# Altium project PlatypusDAQ.PrjPCB (part 2 of 2)

## Sheet GumstixInterface.SchDoc
size C
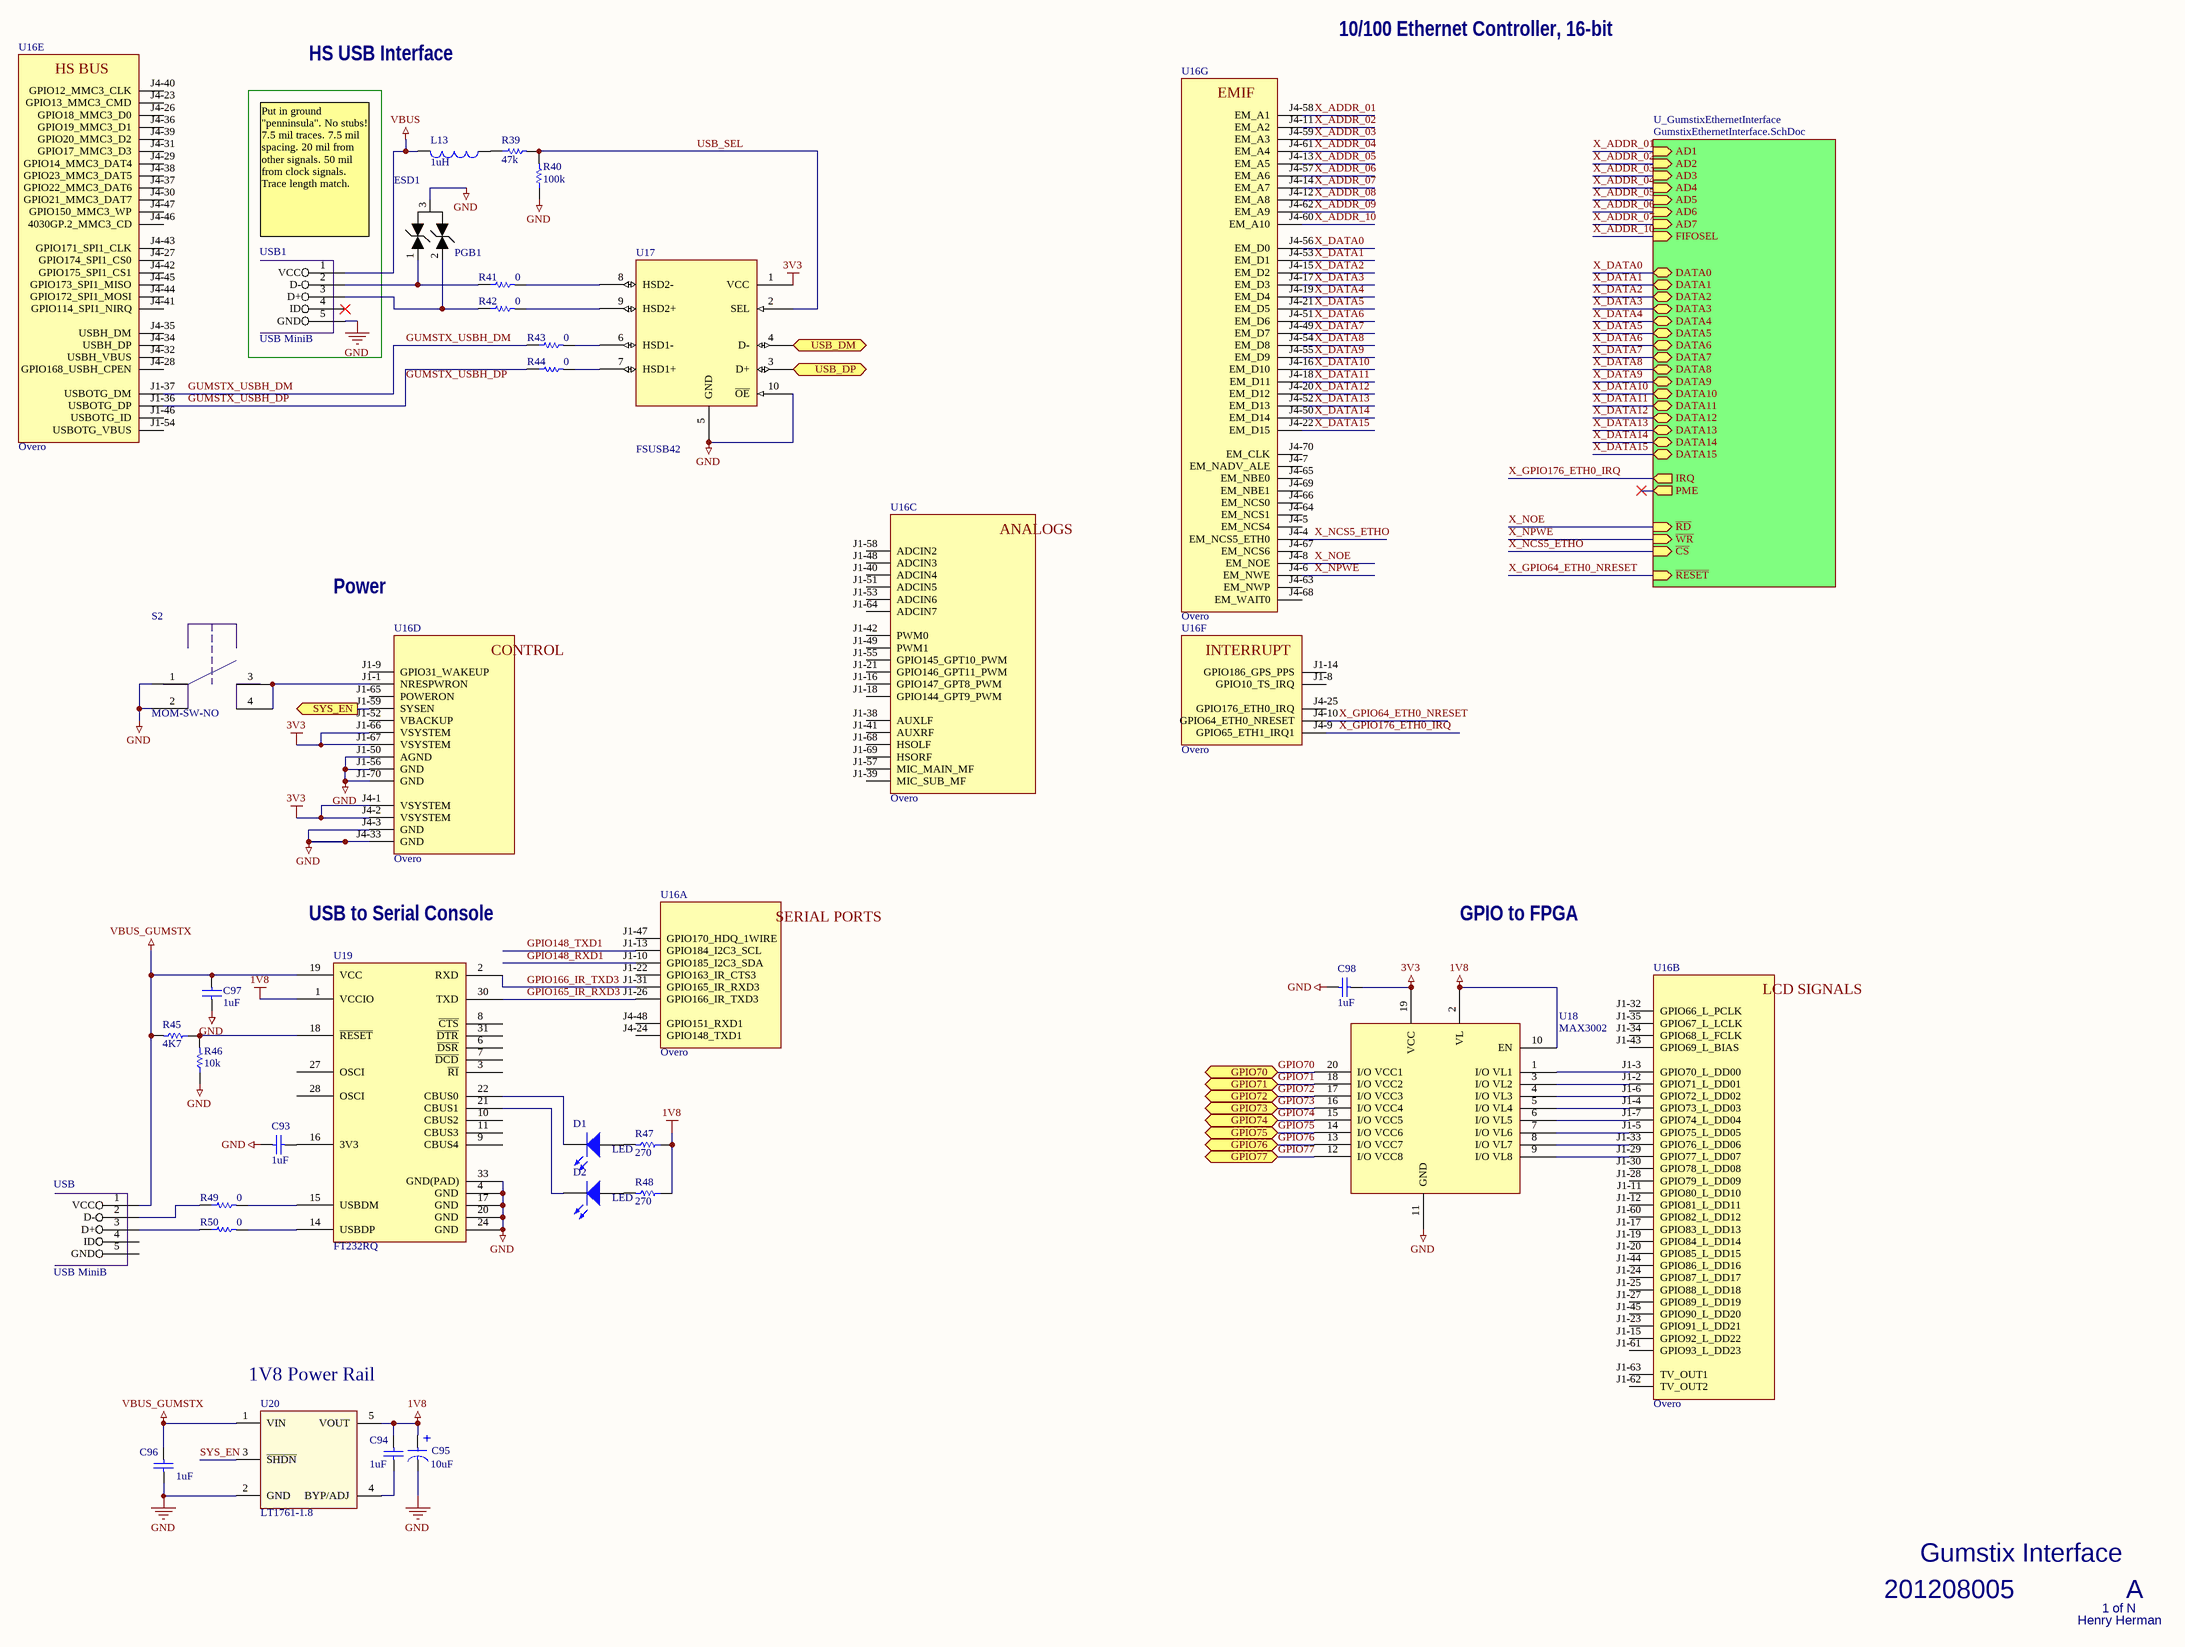
[diagram p4: GumstixInterface.SchDoc]

### Parts
C93  Label: 1uF  [SM/C_0603]  (hidden comment: CAP)
C94  Label: 1uF  [SM/C_0603]  (hidden comment: CAP)
C95  Label: 10uF  [SM/C_POL_0805]  (hidden comment: CAP_POL)
C96  Label: 1uF  [SM/C_0603]  (hidden comment: CAP)
C97  Label: 1uF  [SM/C_0603]  (hidden comment: CAP)
C98  Label: 1uF  [SM/C_0603]  (hidden comment: CAP)
D1  LED  [LED-1206]
D2  LED  [LED-1206]
ESD1  PGB1  [SOT23-PGB1-ESD]
L13  value 1uH  [SM/L_0805]  (hidden comment: Inductor)
R39  value 47k  [SM/R_0603]  (hidden comment: Res)
R40  value 100k  [SM/R_0603]  (hidden comment: Res)
R41  value 0  [SM/R_0603]  (hidden comment: Res)
R42  value 0  [SM/R_0603]  (hidden comment: Res)
R43  value 0  [SM/R_0603]  (hidden comment: Res)
R44  value 0  [SM/R_0603]  (hidden comment: Res)
R45  value 4K7  [SM/R_0603]  (hidden comment: Res)
R46  value 10k  [SM/R_0603]  (hidden comment: Res)
R47  value 270  [SM/R_0603]  (hidden comment: Res)
R48  value 270  [SM/R_0603]  (hidden comment: Res)
R49  value 0  [SM/R_0603]  (hidden comment: Res)
R50  value 0  [SM/R_0603]  (hidden comment: Res)
S2  MOM-SW-NO  [MOM-SW]
U16  Overo  [OVERO]  (parts A,B,C,D,E,F,G of 7)
U17  FSUSB42  [MSOP-10LEAD-FairchildSemi-USBMux]
U18  MAX3002  [TSSOP-20Lead-MAXIM]
U19  FT232RQ  [QFN32-FT232RQ]
U20  LT1761-1.8  [TSOT-23-5Lead-LTC3406A]
USB  USB MiniB  [USB-MINIB]
USB1  USB MiniB  [USB-MINIB]

### Sub-sheets
U_GumstixEthernetInterface = GumstixEthernetInterface.SchDoc: AD1 (in), AD2 (in), AD3 (in), AD4 (in), AD5 (in), AD6 (in), AD7 (in), DATA0 (bidir), DATA1 (bidir), DATA2 (bidir), DATA3 (bidir), DATA4 (bidir), DATA5 (bidir), DATA6 (bidir), DATA7 (bidir), DATA8 (bidir), DATA9 (bidir), DATA10 (bidir), DATA11 (bidir), DATA12 (bidir), DATA13 (bidir), DATA14 (bidir), DATA15 (bidir), ~{RD} (in), ~{WR} (in), ~{CS} (in), IRQ (out), FIFOSEL (in), PME (out), ~{RESET} (in)

### Ports
GPIO70 (bidir), GPIO71 (bidir), GPIO72 (bidir), GPIO73 (bidir), GPIO74 (bidir), GPIO75 (bidir), GPIO76 (bidir), GPIO77 (bidir), SYS_EN (out), USB_DM (bidir), USB_DP (bidir)

### Nets
1V8: C94.2 C95.1 R47.1 R48.1 U18.2(VL) U18.10(EN) U19.1(VCCIO) U20.5(VOUT)
3V3: C98.2 U16.J1-66(VSYSTEM) U16.J1-67(VSYSTEM) U16.J4-1(VSYSTEM) U16.J4-2(VSYSTEM) U17.1(VCC) U18.19(VCC)
GND: C93.2 C95.2 C96.1 C97.2 C98.1 ESD1.3 R40.1 R46.1 S2.1 S2.2 U16.J1-50(AGND) U16.J1-56(GND) U16.J1-70(GND) U16.J4-3(GND) U16.J4-33(GND) U17.5(GND) U17.10(~{OE}) U18.11(GND) U19.4(GND) U19.17(GND) U19.20(GND) U19.24(GND) U19.33(GND(PAD)) U20.2(GND) USB1.5(GND)
VBUS: L13.2 USB1.1(VCC)
VBUS_GUMSTX: C96.2 C97.1 R45.2 U19.19(VCC) U20.1(VIN) USB.1(VCC)
GPIO70: U18.20(I/O_VCC1) ; port GPIO70
GPIO71: U18.18(I/O_VCC2) ; port GPIO71
GPIO72: U18.17(I/O_VCC3) ; port GPIO72
GPIO73: U18.16(I/O_VCC4) ; port GPIO73
GPIO74: U18.15(I/O_VCC5) ; port GPIO74
GPIO75: U18.14(I/O_VCC6) ; port GPIO75
GPIO76: U18.13(I/O_VCC7) ; port GPIO76
GPIO77: U18.12(I/O_VCC8) ; port GPIO77
GPIO148_RXD1: U16.J1-10(GPIO185_I2C3_SDA)
GPIO148_TXD1: U16.J1-13(GPIO184_I2C3_SCL)
GPIO165_IR_RXD3: U16.J1-26(GPIO166_IR_TXD3) U19.30(TXD)
GPIO166_IR_TXD3: U16.J1-31(GPIO165_IR_RXD3) U19.2(RXD)
GUMSTX_USBH_DM: R43.1 U16.J1-37(USBOTG_DM)
GUMSTX_USBH_DP: R44.1 U16.J1-36(USBOTG_DP)
SYS_EN: U20.3(~{SHDN})
USB_SEL: R39.2 R40.2 U17.2(SEL)
X_ADDR_01: U16.J4-58(EM_A1) ; sheet U_GumstixEthernetInterface/AD1
X_ADDR_02: U16.J4-11(EM_A2) ; sheet U_GumstixEthernetInterface/AD2
X_ADDR_03: U16.J4-59(EM_A3) ; sheet U_GumstixEthernetInterface/AD3
X_ADDR_04: U16.J4-61(EM_A4) ; sheet U_GumstixEthernetInterface/AD4
X_ADDR_05: U16.J4-13(EM_A5) ; sheet U_GumstixEthernetInterface/AD5
X_ADDR_06: U16.J4-57(EM_A6) ; sheet U_GumstixEthernetInterface/AD6
X_ADDR_07: U16.J4-14(EM_A7) ; sheet U_GumstixEthernetInterface/AD7
X_ADDR_08: U16.J4-12(EM_A8)
X_ADDR_09: U16.J4-62(EM_A9)
X_ADDR_10: U16.J4-60(EM_A10) ; sheet U_GumstixEthernetInterface/FIFOSEL
X_DATA0: U16.J4-56(EM_D0) ; sheet U_GumstixEthernetInterface/DATA0
X_DATA1: U16.J4-53(EM_D1) ; sheet U_GumstixEthernetInterface/DATA1
X_DATA2: U16.J4-15(EM_D2) ; sheet U_GumstixEthernetInterface/DATA2
X_DATA3: U16.J4-17(EM_D3) ; sheet U_GumstixEthernetInterface/DATA3
X_DATA4: U16.J4-19(EM_D4) ; sheet U_GumstixEthernetInterface/DATA4
X_DATA5: U16.J4-21(EM_D5) ; sheet U_GumstixEthernetInterface/DATA5
X_DATA6: U16.J4-51(EM_D6) ; sheet U_GumstixEthernetInterface/DATA6
X_DATA7: U16.J4-49(EM_D7) ; sheet U_GumstixEthernetInterface/DATA7
X_DATA8: U16.J4-54(EM_D8) ; sheet U_GumstixEthernetInterface/DATA8
X_DATA9: U16.J4-55(EM_D9) ; sheet U_GumstixEthernetInterface/DATA9
X_DATA10: U16.J4-16(EM_D10) ; sheet U_GumstixEthernetInterface/DATA10
X_DATA11: U16.J4-18(EM_D11) ; sheet U_GumstixEthernetInterface/DATA11
X_DATA12: U16.J4-20(EM_D12) ; sheet U_GumstixEthernetInterface/DATA12
X_DATA13: U16.J4-52(EM_D13) ; sheet U_GumstixEthernetInterface/DATA13
X_DATA14: U16.J4-50(EM_D14) ; sheet U_GumstixEthernetInterface/DATA14
X_DATA15: U16.J4-22(EM_D15) ; sheet U_GumstixEthernetInterface/DATA15
X_GPIO64_ETH0_NRESET: U16.J4-10(GPIO64_ETH0_NRESET) ; sheet U_GumstixEthernetInterface/~{RESET}
X_GPIO176_ETH0_IRQ: U16.J4-9(GPIO65_ETH1_IRQ1) ; sheet U_GumstixEthernetInterface/IRQ
X_NCS5_ETHO: U16.J4-4(EM_NCS5_ETH0) ; sheet U_GumstixEthernetInterface/~{CS}
X_NOE: U16.J4-8(EM_NOE) ; sheet U_GumstixEthernetInterface/~{RD}
X_NPWE: U16.J4-6(EM_NWE) ; sheet U_GumstixEthernetInterface/~{WR}
NetC93_1: C93.1 U19.16(3V3)
NetC94_1: C94.1 U20.4(BYP/ADJ)
NetD1_1: D1.1(A) R47.2
NetD1_2: D1.2(K) U19.22(CBUS0)
NetD2_1: D2.1(A) R48.2
NetD2_2: D2.2(K) U19.21(CBUS1)
NetESD1_1: ESD1.1 R41.1 USB1.2(D-)
NetESD1_2: ESD1.2 R42.1 USB1.3(D+)
NetL13_1: L13.1 R39.1
NetR41_2: R41.2 U17.8(HSD2-)
NetR42_2: R42.2 U17.9(HSD2+)
NetR43_2: R43.2 U17.6(HSD1-)
NetR44_2: R44.2 U17.7(HSD1+)
NetR45_1: R45.1 R46.2 U19.18(~{RESET})
NetR49_1: R49.1 USB.2(D-)
NetR49_2: R49.2 U19.15(USBDM)
NetR50_1: R50.1 USB.3(D+)
NetR50_2: R50.2 U19.14(USBDP)
NetS2_3: S2.3 S2.4 U16.J1-1(NRESPWRON)
NetU3_7: U17.4(D-) ; port USB_DM
NetU3_8: U17.3(D+) ; port USB_DP
NetU16_J1-2: U16.J1-2(GPIO71_L_DD01) U18.3(I/O_VL2)
NetU16_J1-3: U16.J1-3(GPIO70_L_DD00) U18.1(I/O_VL1)
NetU16_J1-4: U16.J1-4(GPIO73_L_DD03) U18.5(I/O_VL4)
NetU16_J1-5: U16.J1-5(GPIO75_L_DD05) U18.7(I/O_VL6)
NetU16_J1-6: U16.J1-6(GPIO72_L_DD02) U18.4(I/O_VL3)
NetU16_J1-7: U16.J1-7(GPIO74_L_DD04) U18.6(I/O_VL5)
NetU16_J1-29: U16.J1-29(GPIO77_L_DD07) U18.9(I/O_VL8)
NetU16_J1-33: U16.J1-33(GPIO76_L_DD06) U18.8(I/O_VL7)
NetU16_J1-59: U16.J1-59(SYSEN) ; port SYS_EN

Not connected (* = marked no-connect by the designer): U16 J1-8(GPIO10_TS_IRQ) J1-9(GPIO31_WAKEUP) J1-11(GPIO80_L_DD10) J1-12(GPIO81_L_DD11) J1-14(GPIO186_GPS_PPS) J1-15(GPIO92_L_DD22) J1-16(GPIO147_GPT8_PWM) J1-17(GPIO83_L_DD13) J1-18(GPIO144_GPT9_PWM) J1-19(GPIO84_L_DD14) J1-20(GPIO85_L_DD15) J1-21(GPIO146_GPT11_PWM) J1-22(GPIO163_IR_CTS3) J1-23(GPIO91_L_DD21) J1-24(GPIO87_L_DD17) J1-25(GPIO88_L_DD18) J1-27(GPIO89_L_DD19) J1-28(GPIO79_L_DD09) J1-30(GPIO78_L_DD08) J1-32(GPIO66_L_PCLK) J1-34(GPIO68_L_FCLK) J1-35(GPIO67_L_LCLK) J1-38(AUXLF) J1-39(MIC_SUB_MF) J1-40(ADCIN4) J1-41(AUXRF) J1-42(PWM0) J1-43(GPIO69_L_BIAS) J1-44(GPIO86_L_DD16) J1-45(GPIO90_L_DD20) J1-46(USBOTG_ID) J1-47(GPIO170_HDQ_1WIRE) J1-48(ADCIN3) J1-49(PWM1) J1-51(ADCIN5) J1-52(VBACKUP) J1-53(ADCIN6) J1-54(USBOTG_VBUS) J1-55(GPIO145_GPT10_PWM) J1-57(MIC_MAIN_MF) J1-58(ADCIN2) J1-60(GPIO82_L_DD12) J1-61(GPIO93_L_DD23) J1-62(TV_OUT2) J1-63(TV_OUT1) J1-64(ADCIN7) J1-65(POWERON) J1-68(HSOLF) J1-69(HSORF) J4-5(EM_NCS4) J4-7(EM_NADV_ALE) J4-23(GPIO13_MMC3_CMD) J4-24(GPIO148_TXD1) J4-25(GPIO176_ETH0_IRQ) J4-26(GPIO18_MMC3_D0) J4-27(GPIO174_SPI1_CS0) J4-28(GPIO168_USBH_CPEN) J4-29(GPIO14_MMC3_DAT4) J4-30(GPIO21_MMC3_DAT7) J4-31(GPIO17_MMC3_D3) J4-32(USBH_VBUS) J4-34(USBH_DP) J4-35(USBH_DM) J4-36(GPIO19_MMC3_D1) J4-37(GPIO22_MMC3_DAT6) J4-38(GPIO23_MMC3_DAT5) J4-39(GPIO20_MMC3_D2) J4-40(GPIO12_MMC3_CLK) J4-41(GPIO114_SPI1_NIRQ) J4-42(GPIO175_SPI1_CS1) J4-43(GPIO171_SPI1_CLK) J4-44(GPIO172_SPI1_MOSI) J4-45(GPIO173_SPI1_MISO) J4-46(4030GP.2_MMC3_CD) J4-47(GPIO150_MMC3_WP) J4-48(GPIO151_RXD1) J4-63(EM_NWP) J4-64(EM_NCS1) J4-65(EM_NBE0) J4-66(EM_NCS0) J4-67(EM_NCS6) J4-68(EM_WAIT0) J4-69(EM_NBE1) J4-70(EM_CLK); U19 3(~{RI}) 6(~{DSR}) 7(~{DCD}) 8(~{CTS}) 9(CBUS4) 10(CBUS2) 11(CBUS3) 27(OSCI) 28(OSCI) 31(~{DTR}); USB 4(ID) 5(GND); USB1 4(ID)*

### Notes on the sheet
- 10/100 Ethernet Controller, 16-bit
- HS USB Interface
- Put in ground "penninsula". No stubs! 7.5 mil traces. 7.5 mil spacing. 20 mil from other signals. 50 mil from clock signals.
  Trace length match.
- Power
- USB to Serial Console
- GPIO to FPGA
- (near U20) 1V8 Power Rail
- Gumstix Interface
- 201208005
- Henry Herman
- 1 of N
- A
- (in symbol Overo, part A) SERIAL PORTS
- (in symbol Overo, part B) LCD SIGNALS
- (in symbol Overo, part C) ANALOGS
- (in symbol Overo, part D) CONTROL
- (in symbol Overo, part E) HS BUS
- (in symbol Overo, part F) INTERRUPT
- (in symbol Overo, part G) EMIF

### Library data of the parts
C93 C94 C96-C98 = CAP: Value: 1uF
C95 = CAP_POL: CAP; Value: 10uF
ESD1 = PGB102ST23
R39-R50 = Res: Resistor; Published: 8-Jun-2000; LatestRevisionDate: 17-Jul-2002; LatestRevisionNote: Re-released for DXP Platform.; PackageReference: AXIAL-0.3; Publisher: Altium Limited
S2 = MOM-BUT
U16 = Overo: Gumstix Overo COM
U19 = FT232R
U20 = LT1761-X
USB USB1 = USB MiniB: Mini USB; Published: 8-Jun-2000; LatestRevisionDate: 17-Jan-2003; LatestRevisionNote: PCB Footprint 'BCY-W3/D4.7' replaced; DatasheetDocument: 1997; PackageDocument: Sep-1998; PackageReference: TO-92A; Publisher: Altium Limited; ComponentLink1Description: Manufacturer Link; ComponentLink1URL: http://www.fairchildsemi.com/; ComponentLink2Description: Datasheet; ComponentLink2URL: http://www.fairchildsemi.com/ds/2N%2F2N3904.pdf

## Sheet GumstixEthernetInterface.SchDoc
size B
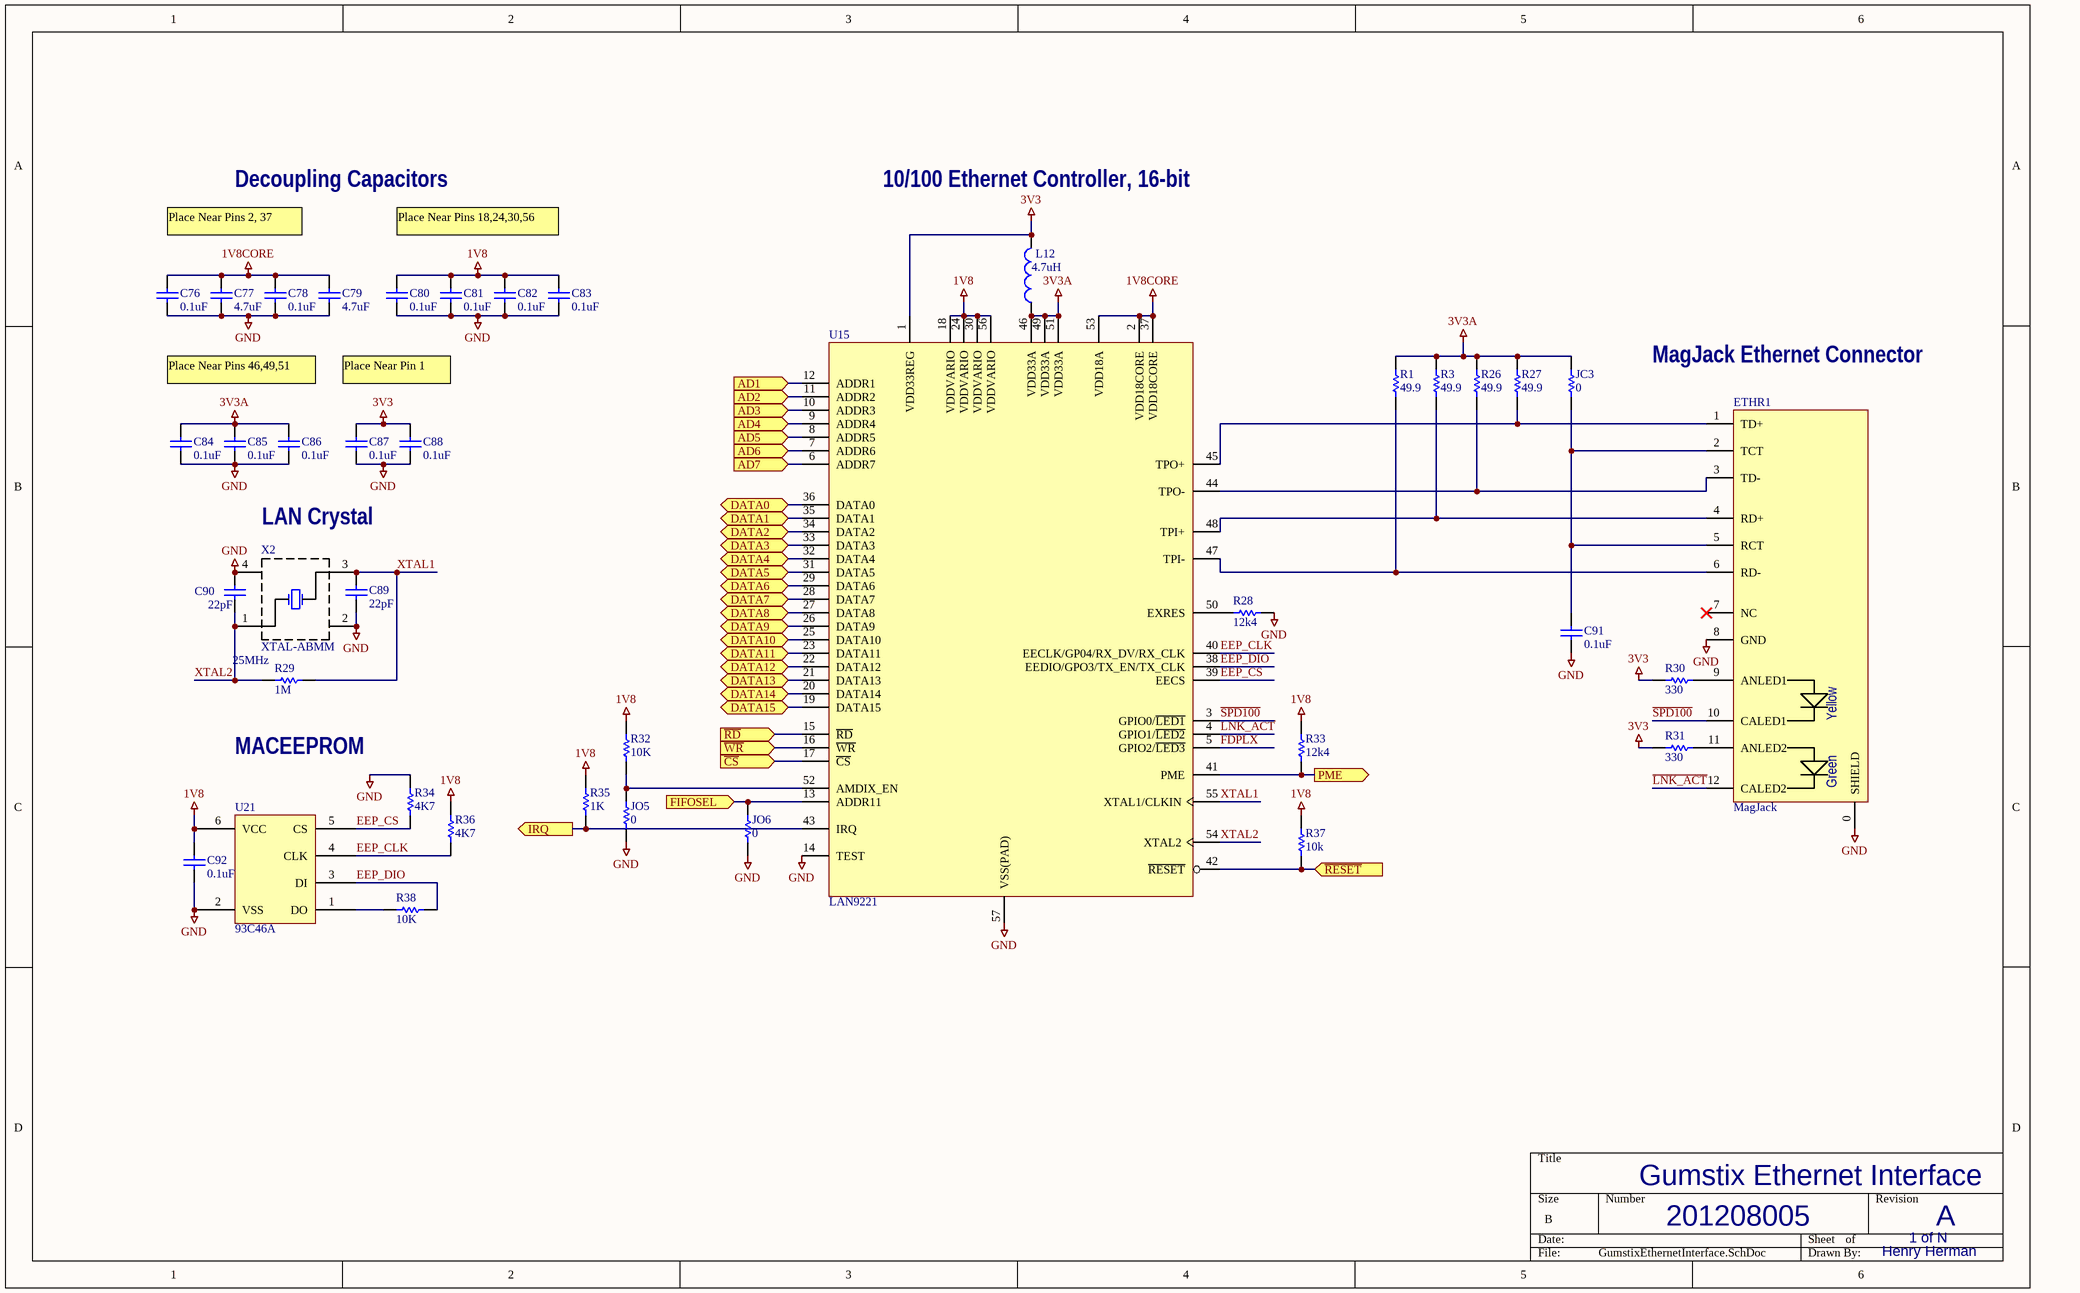
[diagram p5: GumstixEthernetInterface.SchDoc]

### Parts
C76  Label: 0.1uF  [SM/C_0402]  (hidden comment: CAP)
C77  Label: 4.7uF  [SM/C_0603]  (hidden comment: CAP)
C78  Label: 0.1uF  [SM/C_0402]  (hidden comment: CAP)
C79  Label: 4.7uF  [SM/C_0603]  (hidden comment: CAP)
C80  Label: 0.1uF  [SM/C_0402]  (hidden comment: CAP)
C81  Label: 0.1uF  [SM/C_0402]  (hidden comment: CAP)
C82  Label: 0.1uF  [SM/C_0402]  (hidden comment: CAP)
C83  Label: 0.1uF  [SM/C_0402]  (hidden comment: CAP)
C84  Label: 0.1uF  [SM/C_0402]  (hidden comment: CAP)
C85  Label: 0.1uF  [SM/C_0402]  (hidden comment: CAP)
C86  Label: 0.1uF  [SM/C_0402]  (hidden comment: CAP)
C87  Label: 0.1uF  [SM/C_0402]  (hidden comment: CAP)
C88  Label: 0.1uF  [SM/C_0402]  (hidden comment: CAP)
C89  Label: 22pF  [SM/C_0402]  (hidden comment: CAP)
C90  Label: 22pF  [SM/C_0402]  (hidden comment: CAP)
C91  Label: 0.1uF  [SM/C_0402]  (hidden comment: CAP)
C92  Label: 0.1uF  [SM/C_0603]  (hidden comment: CAP)
ETHR1  MagJack  [MagJack]
JC3  value 0  [SM/R_0603]  (hidden comment: Res)
JO5  value 0  [SM/R_0603]  (hidden comment: Res)
JO6  value 0  [SM/R_0603]  (hidden comment: Res)
L12  value 4.7uH  [SM/L_0805]  (hidden comment: Inductor)
R1  value 49.9  [SM/R_0603]  (hidden comment: Res)
R3  value 49.9  [SM/R_0603]  (hidden comment: Res)
R26  value 49.9  [SM/R_0603]  (hidden comment: Res)
R27  value 49.9  [SM/R_0603]  (hidden comment: Res)
R28  value 12k4  [SM/R_0603]  (hidden comment: Res)
R29  value 1M  [SM/R_0603]  (hidden comment: Res)
R30  value 330  [SM/R_0603]  (hidden comment: Res)
R31  value 330  [SM/R_0603]  (hidden comment: Res)
R32  value 10K  [SM/R_0603]  (hidden comment: Res)
R33  value 12k4  [SM/R_0603]  (hidden comment: Res)
R34  value 4K7  [SM/R_0603]  (hidden comment: Res)
R35  value 1K  [SM/R_0603]  (hidden comment: Res)
R36  value 4K7  [SM/R_0603]  (hidden comment: Res)
R37  value 10k  [SM/R_0603]  (hidden comment: Res)
R38  value 10K  [SM/R_0603]  (hidden comment: Res)
U15  LAN9221  [QFN-56Pin-SMSC-LAN9221]
U21  93C46A  [SOT23-93C46-EEPROM-Microchip]
X2  XTAL-ABMM  value 25MHz  [ABMM-Crystal]

### Ports
AD1 (in), AD2 (in), AD3 (in), AD4 (in), AD5 (in), AD6 (in), AD7 (in), DATA0 (bidir), DATA1 (bidir), DATA2 (bidir), DATA3 (bidir), DATA4 (bidir), DATA5 (bidir), DATA6 (bidir), DATA7 (bidir), DATA8 (bidir), DATA9 (bidir), DATA10 (bidir), DATA11 (bidir), DATA12 (bidir), DATA13 (bidir), DATA14 (bidir), DATA15 (bidir), FIFOSEL (in), IRQ (out), PME (out), ~{CS} (in), ~{RD} (in), ~{RESET} (in), ~{WR} (in)

### Nets
1V8: C80.2 C81.2 C82.2 C83.2 C92.2 R32.2 R33.1 R35.2 R36.2 R37.1 U15.18(VDDVARIO) U15.24(VDDVARIO) U15.30(VDDVARIO) U15.56(VDDVARIO) U21.6(VCC)
1V8CORE: C76.2 C77.2 C78.2 C79.2 U15.2(VDD18CORE) U15.37(VDD18CORE) U15.53(VDD18A)
3V3: C87.2 C88.2 L12.2 R30.2 R31.2 U15.1(VDD33REG)
3V3A: C84.2 C85.2 C86.2 JC3.2 L12.1 R1.2 R3.2 R26.2 R27.2 U15.46(VDD33A) U15.49(VDD33A) U15.51(VDD33A)
GND: C76.1 C77.1 C78.1 C79.1 C80.1 C81.1 C82.1 C83.1 C84.1 C85.1 C86.1 C87.1 C88.1 C89.1 C90.2 C91.1 C92.1 ETHR1.0(SHIELD) ETHR1.8(GND) JO5.1 JO6.1 R28.2 R34.2 U15.14(TEST) U15.57(VSS(PAD)) U21.2(VSS) X2.2 X2.4
EEP_CLK: R36.1 U15.40(EECLK/GP04/RX_DV/RX_CLK) U21.4(CLK)
EEP_CS: R34.1 U15.39(EECS) U21.5(CS)
EEP_DIO: R38.1 U15.38(EEDIO/GPO3/TX_EN/TX_CLK) U21.3(DI)
~{FDPLX}: U15.5(GPIO2/~{LED3})
~{LNK_ACT}: ETHR1.12(CALED2) U15.4(GPIO1/~{LED2})
~{SPD100}: ETHR1.10(CALED1) U15.3(GPIO0/~{LED1})
X_ADDR_01: U15.12(ADDR1) ; port AD1
X_ADDR_02: U15.11(ADDR2) ; port AD2
X_ADDR_03: U15.10(ADDR3) ; port AD3
X_ADDR_04: U15.9(ADDR4) ; port AD4
X_ADDR_05: U15.8(ADDR5) ; port AD5
X_ADDR_06: U15.7(ADDR6) ; port AD6
X_ADDR_07: U15.6(ADDR7) ; port AD7
X_ADDR_10: JO6.2 U15.13(ADDR11) ; port FIFOSEL
X_DATA0: U15.36(DATA0) ; port DATA0
X_DATA1: U15.35(DATA1) ; port DATA1
X_DATA2: U15.34(DATA2) ; port DATA2
X_DATA3: U15.33(DATA3) ; port DATA3
X_DATA4: U15.32(DATA4) ; port DATA4
X_DATA5: U15.31(DATA5) ; port DATA5
X_DATA6: U15.29(DATA6) ; port DATA6
X_DATA7: U15.28(DATA7) ; port DATA7
X_DATA8: U15.27(DATA8) ; port DATA8
X_DATA9: U15.26(DATA9) ; port DATA9
X_DATA10: U15.25(DATA10) ; port DATA10
X_DATA11: U15.23(DATA11) ; port DATA11
X_DATA12: U15.22(DATA12) ; port DATA12
X_DATA13: U15.21(DATA13) ; port DATA13
X_DATA14: U15.20(DATA14) ; port DATA14
X_DATA15: U15.19(DATA15) ; port DATA15
X_GPIO64_ETH0_NRESET: R37.2 U15.42(~{RESET}) ; port ~{RESET}
X_GPIO176_ETH0_IRQ: R35.1 U15.43(IRQ) ; port IRQ
X_NCS5_ETHO: U15.17(~{CS}) ; port ~{CS}
X_NOE: U15.15(~{RD}) ; port ~{RD}
X_NPWE: U15.16(~{WR}) ; port ~{WR}
XTAL1: C89.2 R29.2 U15.55(XTAL1/CLKIN) X2.3
XTAL2: C90.1 R29.1 U15.54(XTAL2) X2.1
NetC91_2: C91.2 ETHR1.2(TCT) ETHR1.5(RCT) JC3.1
NetETHR1_1: ETHR1.1(TD+) R27.1 U15.45(TPO+)
NetETHR1_3: ETHR1.3(TD-) R26.1 U15.44(TPO-)
NetETHR1_4: ETHR1.4(RD+) R3.1 U15.48(TPI+)
NetETHR1_6: ETHR1.6(RD-) R1.1 U15.47(TPI-)
NetETHR1_9: ETHR1.9(ANLED1) R30.1
NetETHR1_11: ETHR1.11(ANLED2) R31.1
NetJO5_2: JO5.2 R32.1 U15.52(AMDIX_EN)
NetR28_1: R28.1 U15.50(EXRES)
NetR33_2: R33.2 U15.41(PME) ; port PME
NetR38_2: R38.2 U21.1(DO)

Not connected (* = marked no-connect by the designer): ETHR1 7(NC)*

### Notes on the sheet
- Place Near Pins 2, 37
- Decoupling Capacitors
- Place Near Pins 18,24,30,56
- 10/100 Ethernet Controller, 16-bit
- MagJack Ethernet Connector
- Place Near Pins 46,49,51
- Place Near Pin 1
- LAN Crystal
- MACEEPROM
- Gumstix Ethernet Interface
- 201208005
- 1 of N
- A
- Henry Herman
- (in symbol MAGJACK-SI-60062) Yellow; Green

### Library data of the parts
C76 C78 C80-C88 C91 C92 = CAP: Value: 0.1uF
C77 C79 = CAP: Value: 4.7uF
C89 C90 = CAP: Value: 22pF
ETHR1 = MAGJACK-SI-60062
JC3 JO5 JO6 R1 R3 R26-R38 = Res: Resistor; Published: 8-Jun-2000; LatestRevisionDate: 17-Jul-2002; LatestRevisionNote: Re-released for DXP Platform.; PackageReference: AXIAL-0.3; Publisher: Altium Limited
U21 = 93CX6-EEPROM

## Nets that join several sheets
1V2: PlatypusDAQ (8 pins), Power_Supply (C53.2 C55.1 U9.5)
1V8: GumstixInterface (8 pins), GumstixEthernetInterface (15 pins)
2V5: PlatypusDAQ (18 pins), Power_Supply (C52.2 C54.1 U8.5)
3V3: PlatypusDAQ (54 pins), UDAS (C1_UDAS#1.2 U1_UDAS#1.23 U1_UDAS#1.34), UDAS (C1_UDAS#2.2 U1_UDAS#2.23 U1_UDAS#2.34), UDAS (C1_UDAS#3.2 U1_UDAS#3.23 U1_UDAS#3.34), UDAS (C1_UDAS#4.2 U1_UDAS#4.23 U1_UDAS#4.34), UDAS (C1_UDAS#5.2 U1_UDAS#5.23 U1_UDAS#5.34), UDAS (C1_UDAS#6.2 U1_UDAS#6.23 U1_UDAS#6.34), UDAS (C1_UDAS#7.2 U1_UDAS#7.23 U1_UDAS#7.34), UDAS (C1_UDAS#8.2 U1_UDAS#8.23 U1_UDAS#8.34), Power_Supply (C58.1 U6.3), GumstixInterface (7 pins), GumstixEthernetInterface (6 pins)
5V: UDAS (8 pins), UDAS (8 pins), UDAS (8 pins), UDAS (8 pins), UDAS (8 pins), UDAS (8 pins), UDAS (8 pins), UDAS (8 pins), Power_Supply (C59.1 D4.1 U7.3)
+10V: PlatypusDAQ (8 pins), Power_Supply (C60.1 L5.1 L7.1 L8.1)
+12V: PlatypusDAQ (CON1.19 CON1.21), Power_Supply (15 pins)
-10V: PlatypusDAQ (8 pins), Power_Supply (C70.2 L9.1 L10.1 L11.1)
-12V: PlatypusDAQ (CON1.20 CON1.22), Power_Supply (6 pins)
GND: PlatypusDAQ (201 pins), UDAS (26 pins), UDAS (26 pins), UDAS (26 pins), UDAS (26 pins), UDAS (26 pins), UDAS (26 pins), UDAS (26 pins), UDAS (26 pins), Power_Supply (48 pins), GumstixInterface (25 pins), GumstixEthernetInterface (28 pins)
VBUS: PlatypusDAQ (R11.1), GumstixInterface (L13.2 USB1.1)
BSY1: PlatypusDAQ (U2.115), UDAS (U1_UDAS#1.14)
BSY2: PlatypusDAQ (U2.110), UDAS (U1_UDAS#2.14)
BSY3: PlatypusDAQ (U2.106), UDAS (U1_UDAS#3.14)
BSY4: PlatypusDAQ (U2.80), UDAS (U1_UDAS#4.14)
BSY5: PlatypusDAQ (U2.72), UDAS (U1_UDAS#8.14)
BSY6: PlatypusDAQ (U2.71), UDAS (U1_UDAS#7.14)
BSY7: PlatypusDAQ (U2.58), UDAS (U1_UDAS#6.14)
BSY8: PlatypusDAQ (U2.57), UDAS (U1_UDAS#5.14)
CONVST: PlatypusDAQ (U2.74), UDAS (U1_UDAS#1.9 U1_UDAS#1.10), UDAS (U1_UDAS#2.9 U1_UDAS#2.10), UDAS (U1_UDAS#3.9 U1_UDAS#3.10), UDAS (U1_UDAS#4.9 U1_UDAS#4.10), UDAS (U1_UDAS#5.9 U1_UDAS#5.10), UDAS (U1_UDAS#6.9 U1_UDAS#6.10), UDAS (U1_UDAS#7.9 U1_UDAS#7.10), UDAS (U1_UDAS#8.9 U1_UDAS#8.10)
DASCS1: PlatypusDAQ (U2.116), UDAS (U1_UDAS#1.13)
DASCS2: PlatypusDAQ (U2.109), UDAS (U1_UDAS#2.13)
DASCS3: PlatypusDAQ (U2.107), UDAS (U1_UDAS#3.13)
DASCS4: PlatypusDAQ (U2.65), UDAS (U1_UDAS#4.13)
DASCS5: PlatypusDAQ (U2.63), UDAS (U1_UDAS#8.13)
DASCS6: PlatypusDAQ (U2.62), UDAS (U1_UDAS#7.13)
DASCS7: PlatypusDAQ (U2.60), UDAS (U1_UDAS#6.13)
DASCS8: PlatypusDAQ (U2.42), UDAS (U1_UDAS#5.13)
DASRD: PlatypusDAQ (U2.68), UDAS (U1_UDAS#1.12), UDAS (U1_UDAS#2.12), UDAS (U1_UDAS#3.12), UDAS (U1_UDAS#4.12), UDAS (U1_UDAS#5.12), UDAS (U1_UDAS#6.12), UDAS (U1_UDAS#7.12), UDAS (U1_UDAS#8.12)
DASRST: PlatypusDAQ (U2.69), UDAS (U1_UDAS#1.11), UDAS (U1_UDAS#2.11), UDAS (U1_UDAS#3.11), UDAS (U1_UDAS#4.11), UDAS (U1_UDAS#5.11), UDAS (U1_UDAS#6.11), UDAS (U1_UDAS#7.11), UDAS (U1_UDAS#8.11)
DASSTBY: PlatypusDAQ (U2.75), UDAS (U1_UDAS#1.7), UDAS (U1_UDAS#2.7), UDAS (U1_UDAS#3.7), UDAS (U1_UDAS#4.7), UDAS (U1_UDAS#5.7), UDAS (U1_UDAS#6.7), UDAS (U1_UDAS#7.7), UDAS (U1_UDAS#8.7)
DB0: PlatypusDAQ (U2.82), UDAS (U1_UDAS#1.16), UDAS (U1_UDAS#2.16), UDAS (U1_UDAS#3.16), UDAS (U1_UDAS#4.16), UDAS (U1_UDAS#5.16), UDAS (U1_UDAS#6.16), UDAS (U1_UDAS#7.16), UDAS (U1_UDAS#8.16)
DB1: PlatypusDAQ (U2.83), UDAS (U1_UDAS#1.17), UDAS (U1_UDAS#2.17), UDAS (U1_UDAS#3.17), UDAS (U1_UDAS#4.17), UDAS (U1_UDAS#5.17), UDAS (U1_UDAS#6.17), UDAS (U1_UDAS#7.17), UDAS (U1_UDAS#8.17)
DB2: PlatypusDAQ (U2.84), UDAS (U1_UDAS#1.18), UDAS (U1_UDAS#2.18), UDAS (U1_UDAS#3.18), UDAS (U1_UDAS#4.18), UDAS (U1_UDAS#5.18), UDAS (U1_UDAS#6.18), UDAS (U1_UDAS#7.18), UDAS (U1_UDAS#8.18)
DB3: PlatypusDAQ (U2.86), UDAS (U1_UDAS#1.19), UDAS (U1_UDAS#2.19), UDAS (U1_UDAS#3.19), UDAS (U1_UDAS#4.19), UDAS (U1_UDAS#5.19), UDAS (U1_UDAS#6.19), UDAS (U1_UDAS#7.19), UDAS (U1_UDAS#8.19)
DB4: PlatypusDAQ (U2.89), UDAS (U1_UDAS#1.20), UDAS (U1_UDAS#2.20), UDAS (U1_UDAS#3.20), UDAS (U1_UDAS#4.20), UDAS (U1_UDAS#5.20), UDAS (U1_UDAS#6.20), UDAS (U1_UDAS#7.20), UDAS (U1_UDAS#8.20)
DB5: PlatypusDAQ (U2.90), UDAS (U1_UDAS#1.21), UDAS (U1_UDAS#2.21), UDAS (U1_UDAS#3.21), UDAS (U1_UDAS#4.21), UDAS (U1_UDAS#5.21), UDAS (U1_UDAS#6.21), UDAS (U1_UDAS#7.21), UDAS (U1_UDAS#8.21)
DB6: PlatypusDAQ (U2.91), UDAS (U1_UDAS#1.22), UDAS (U1_UDAS#2.22), UDAS (U1_UDAS#3.22), UDAS (U1_UDAS#4.22), UDAS (U1_UDAS#5.22), UDAS (U1_UDAS#6.22), UDAS (U1_UDAS#7.22), UDAS (U1_UDAS#8.22)
DB7: PlatypusDAQ (U2.93), UDAS (U1_UDAS#1.24), UDAS (U1_UDAS#2.24), UDAS (U1_UDAS#3.24), UDAS (U1_UDAS#4.24), UDAS (U1_UDAS#5.24), UDAS (U1_UDAS#6.24), UDAS (U1_UDAS#7.24), UDAS (U1_UDAS#8.24)
DB8: PlatypusDAQ (U2.94), UDAS (U1_UDAS#1.25), UDAS (U1_UDAS#2.25), UDAS (U1_UDAS#3.25), UDAS (U1_UDAS#4.25), UDAS (U1_UDAS#5.25), UDAS (U1_UDAS#6.25), UDAS (U1_UDAS#7.25), UDAS (U1_UDAS#8.25)
DB9: PlatypusDAQ (U2.96), UDAS (U1_UDAS#1.27), UDAS (U1_UDAS#2.27), UDAS (U1_UDAS#3.27), UDAS (U1_UDAS#4.27), UDAS (U1_UDAS#5.27), UDAS (U1_UDAS#6.27), UDAS (U1_UDAS#7.27), UDAS (U1_UDAS#8.27)
DB10: PlatypusDAQ (U2.97), UDAS (U1_UDAS#1.28), UDAS (U1_UDAS#2.28), UDAS (U1_UDAS#3.28), UDAS (U1_UDAS#4.28), UDAS (U1_UDAS#5.28), UDAS (U1_UDAS#6.28), UDAS (U1_UDAS#7.28), UDAS (U1_UDAS#8.28)
DB11: PlatypusDAQ (U2.98), UDAS (U1_UDAS#1.29), UDAS (U1_UDAS#2.29), UDAS (U1_UDAS#3.29), UDAS (U1_UDAS#4.29), UDAS (U1_UDAS#5.29), UDAS (U1_UDAS#6.29), UDAS (U1_UDAS#7.29), UDAS (U1_UDAS#8.29)
DB12: PlatypusDAQ (U2.99), UDAS (U1_UDAS#1.30), UDAS (U1_UDAS#2.30), UDAS (U1_UDAS#3.30), UDAS (U1_UDAS#4.30), UDAS (U1_UDAS#5.30), UDAS (U1_UDAS#6.30), UDAS (U1_UDAS#7.30), UDAS (U1_UDAS#8.30)
DB13: PlatypusDAQ (U2.100), UDAS (U1_UDAS#1.31), UDAS (U1_UDAS#2.31), UDAS (U1_UDAS#3.31), UDAS (U1_UDAS#4.31), UDAS (U1_UDAS#5.31), UDAS (U1_UDAS#6.31), UDAS (U1_UDAS#7.31), UDAS (U1_UDAS#8.31)
DB14: PlatypusDAQ (U2.101), UDAS (U1_UDAS#1.32), UDAS (U1_UDAS#2.32), UDAS (U1_UDAS#3.32), UDAS (U1_UDAS#4.32), UDAS (U1_UDAS#5.32), UDAS (U1_UDAS#6.32), UDAS (U1_UDAS#7.32), UDAS (U1_UDAS#8.32)
DB15: PlatypusDAQ (U2.102), UDAS (U1_UDAS#1.33), UDAS (U1_UDAS#2.33), UDAS (U1_UDAS#3.33), UDAS (U1_UDAS#4.33), UDAS (U1_UDAS#5.33), UDAS (U1_UDAS#6.33), UDAS (U1_UDAS#7.33), UDAS (U1_UDAS#8.33)
FRST1: PlatypusDAQ (U2.113), UDAS (U1_UDAS#1.15)
GPIO70: PlatypusDAQ (CON10.19 U2.40), GumstixInterface (U18.20)
GPIO71: PlatypusDAQ (CON10.17 U2.36), GumstixInterface (U18.18)
GPIO72: PlatypusDAQ (CON10.15 U2.34), GumstixInterface (U18.17)
GPIO73: PlatypusDAQ (CON10.13 U2.32), GumstixInterface (U18.16)
GPIO74: PlatypusDAQ (CON10.11 U2.30), GumstixInterface (U18.15)
GPIO75: PlatypusDAQ (CON10.9 U2.28), GumstixInterface (U18.14)
GPIO76: PlatypusDAQ (CON10.7 U2.25), GumstixInterface (U18.13)
GPIO77: PlatypusDAQ (CON10.5 U2.23), GumstixInterface (U18.12)
NetU3_7: PlatypusDAQ (U3.7), GumstixInterface (U17.4)
NetU3_8: PlatypusDAQ (U3.8), GumstixInterface (U17.3)
OS0: PlatypusDAQ (U2.78), UDAS (U1_UDAS#1.3), UDAS (U1_UDAS#2.3), UDAS (U1_UDAS#3.3), UDAS (U1_UDAS#4.3), UDAS (U1_UDAS#5.3), UDAS (U1_UDAS#6.3), UDAS (U1_UDAS#7.3), UDAS (U1_UDAS#8.3)
OS1: PlatypusDAQ (U2.77), UDAS (U1_UDAS#1.4), UDAS (U1_UDAS#2.4), UDAS (U1_UDAS#3.4), UDAS (U1_UDAS#4.4), UDAS (U1_UDAS#5.4), UDAS (U1_UDAS#6.4), UDAS (U1_UDAS#7.4), UDAS (U1_UDAS#8.4)
OS2: PlatypusDAQ (U2.76), UDAS (U1_UDAS#1.5), UDAS (U1_UDAS#2.5), UDAS (U1_UDAS#3.5), UDAS (U1_UDAS#4.5), UDAS (U1_UDAS#5.5), UDAS (U1_UDAS#6.5), UDAS (U1_UDAS#7.5), UDAS (U1_UDAS#8.5)
RANGE1: PlatypusDAQ (U2.119), UDAS (U1_UDAS#1.8)
RANGE2: PlatypusDAQ (U2.112), UDAS (U1_UDAS#2.8)
RANGE3: PlatypusDAQ (U2.108), UDAS (U1_UDAS#3.8)
RANGE4: PlatypusDAQ (U2.64), UDAS (U1_UDAS#4.8)
RANGE5: PlatypusDAQ (U2.56), UDAS (U1_UDAS#8.8)
RANGE6: PlatypusDAQ (U2.50), UDAS (U1_UDAS#7.8)
RANGE7: PlatypusDAQ (U2.49), UDAS (U1_UDAS#6.8)
RANGE8: PlatypusDAQ (U2.48), UDAS (U1_UDAS#5.8)
VIN1: PlatypusDAQ (CON2.2), UDAS (U1_UDAS#1.49)
VIN2: PlatypusDAQ (CON2.4), UDAS (U1_UDAS#1.51)
VIN3: PlatypusDAQ (CON2.6), UDAS (U1_UDAS#1.53)
VIN4: PlatypusDAQ (CON2.8), UDAS (U1_UDAS#1.55)
VIN5: PlatypusDAQ (CON2.10), UDAS (U1_UDAS#1.57)
VIN6: PlatypusDAQ (CON2.12), UDAS (U1_UDAS#1.59)
VIN7: PlatypusDAQ (JC1.2 JO3.2), UDAS (U1_UDAS#1.61)
VIN8: PlatypusDAQ (JC2.1 JO4.2), UDAS (U1_UDAS#1.63)
VIN9: PlatypusDAQ (CON3.2), UDAS (U1_UDAS#2.49)
VIN10: PlatypusDAQ (CON3.4), UDAS (U1_UDAS#2.51)
VIN11: PlatypusDAQ (CON3.6), UDAS (U1_UDAS#2.53)
VIN12: PlatypusDAQ (CON3.8), UDAS (U1_UDAS#2.55)
VIN13: PlatypusDAQ (CON3.10), UDAS (U1_UDAS#2.57)
VIN14: PlatypusDAQ (CON3.12), UDAS (U1_UDAS#2.59)
VIN15: PlatypusDAQ (CON3.14), UDAS (U1_UDAS#2.61)
VIN16: PlatypusDAQ (CON3.16), UDAS (U1_UDAS#2.63)
VIN17: PlatypusDAQ (CON4.2), UDAS (U1_UDAS#3.49)
VIN18: PlatypusDAQ (CON4.4), UDAS (U1_UDAS#3.51)
VIN19: PlatypusDAQ (CON4.6), UDAS (U1_UDAS#3.53)
VIN20: PlatypusDAQ (CON4.8), UDAS (U1_UDAS#3.55)
VIN21: PlatypusDAQ (CON4.10), UDAS (U1_UDAS#3.57)
VIN22: PlatypusDAQ (CON4.12), UDAS (U1_UDAS#3.59)
VIN23: PlatypusDAQ (CON4.14), UDAS (U1_UDAS#3.61)
VIN24: PlatypusDAQ (CON4.16), UDAS (U1_UDAS#3.63)
VIN25: PlatypusDAQ (CON5.2), UDAS (U1_UDAS#4.49)
VIN26: PlatypusDAQ (CON5.4), UDAS (U1_UDAS#4.51)
VIN27: PlatypusDAQ (CON5.6), UDAS (U1_UDAS#4.53)
VIN28: PlatypusDAQ (CON5.8), UDAS (U1_UDAS#4.55)
VIN29: PlatypusDAQ (CON5.10), UDAS (U1_UDAS#4.57)
VIN30: PlatypusDAQ (CON5.12), UDAS (U1_UDAS#4.59)
VIN31: PlatypusDAQ (CON5.14), UDAS (U1_UDAS#4.61)
VIN32: PlatypusDAQ (CON5.16), UDAS (U1_UDAS#4.63)
VIN33: PlatypusDAQ (CON6.2), UDAS (U1_UDAS#8.49)
VIN34: PlatypusDAQ (CON6.4), UDAS (U1_UDAS#8.51)
VIN35: PlatypusDAQ (CON6.6), UDAS (U1_UDAS#8.53)
VIN36: PlatypusDAQ (CON6.8), UDAS (U1_UDAS#8.55)
VIN37: PlatypusDAQ (CON6.10), UDAS (U1_UDAS#8.57)
VIN38: PlatypusDAQ (CON6.12), UDAS (U1_UDAS#8.59)
VIN39: PlatypusDAQ (CON6.14), UDAS (U1_UDAS#8.61)
VIN40: PlatypusDAQ (CON6.16), UDAS (U1_UDAS#8.63)
VIN41: PlatypusDAQ (CON7.2), UDAS (U1_UDAS#7.49)
VIN42: PlatypusDAQ (CON7.4), UDAS (U1_UDAS#7.51)
VIN43: PlatypusDAQ (CON7.6), UDAS (U1_UDAS#7.53)
VIN44: PlatypusDAQ (CON7.8), UDAS (U1_UDAS#7.55)
VIN45: PlatypusDAQ (CON7.10), UDAS (U1_UDAS#7.57)
VIN46: PlatypusDAQ (CON7.12), UDAS (U1_UDAS#7.59)
VIN47: PlatypusDAQ (CON7.14), UDAS (U1_UDAS#7.61)
VIN48: PlatypusDAQ (CON7.16), UDAS (U1_UDAS#7.63)
VIN49: PlatypusDAQ (CON8.2), UDAS (U1_UDAS#6.49)
VIN50: PlatypusDAQ (CON8.4), UDAS (U1_UDAS#6.51)
VIN51: PlatypusDAQ (CON8.6), UDAS (U1_UDAS#6.53)
VIN52: PlatypusDAQ (CON8.8), UDAS (U1_UDAS#6.55)
VIN53: PlatypusDAQ (CON8.10), UDAS (U1_UDAS#6.57)
VIN54: PlatypusDAQ (CON8.12), UDAS (U1_UDAS#6.59)
VIN55: PlatypusDAQ (CON8.14), UDAS (U1_UDAS#6.61)
VIN56: PlatypusDAQ (CON8.16), UDAS (U1_UDAS#6.63)
VIN57: PlatypusDAQ (CON9.2), UDAS (U1_UDAS#5.49)
VIN58: PlatypusDAQ (CON9.4), UDAS (U1_UDAS#5.51)
VIN59: PlatypusDAQ (CON9.6), UDAS (U1_UDAS#5.53)
VIN60: PlatypusDAQ (CON9.8), UDAS (U1_UDAS#5.55)
VIN61: PlatypusDAQ (CON9.10), UDAS (U1_UDAS#5.57)
VIN62: PlatypusDAQ (CON9.12), UDAS (U1_UDAS#5.59)
VIN63: PlatypusDAQ (CON9.14), UDAS (U1_UDAS#5.61)
VIN64: PlatypusDAQ (CON9.16), UDAS (U1_UDAS#5.63)
X_ADDR_01: GumstixInterface (U16.J4-58), GumstixEthernetInterface (U15.12)
X_ADDR_02: GumstixInterface (U16.J4-11), GumstixEthernetInterface (U15.11)
X_ADDR_03: GumstixInterface (U16.J4-59), GumstixEthernetInterface (U15.10)
X_ADDR_04: GumstixInterface (U16.J4-61), GumstixEthernetInterface (U15.9)
X_ADDR_05: GumstixInterface (U16.J4-13), GumstixEthernetInterface (U15.8)
X_ADDR_06: GumstixInterface (U16.J4-57), GumstixEthernetInterface (U15.7)
X_ADDR_07: GumstixInterface (U16.J4-14), GumstixEthernetInterface (U15.6)
X_ADDR_10: GumstixInterface (U16.J4-60), GumstixEthernetInterface (JO6.2 U15.13)
X_DATA0: GumstixInterface (U16.J4-56), GumstixEthernetInterface (U15.36)
X_DATA1: GumstixInterface (U16.J4-53), GumstixEthernetInterface (U15.35)
X_DATA2: GumstixInterface (U16.J4-15), GumstixEthernetInterface (U15.34)
X_DATA3: GumstixInterface (U16.J4-17), GumstixEthernetInterface (U15.33)
X_DATA4: GumstixInterface (U16.J4-19), GumstixEthernetInterface (U15.32)
X_DATA5: GumstixInterface (U16.J4-21), GumstixEthernetInterface (U15.31)
X_DATA6: GumstixInterface (U16.J4-51), GumstixEthernetInterface (U15.29)
X_DATA7: GumstixInterface (U16.J4-49), GumstixEthernetInterface (U15.28)
X_DATA8: GumstixInterface (U16.J4-54), GumstixEthernetInterface (U15.27)
X_DATA9: GumstixInterface (U16.J4-55), GumstixEthernetInterface (U15.26)
X_DATA10: GumstixInterface (U16.J4-16), GumstixEthernetInterface (U15.25)
X_DATA11: GumstixInterface (U16.J4-18), GumstixEthernetInterface (U15.23)
X_DATA12: GumstixInterface (U16.J4-20), GumstixEthernetInterface (U15.22)
X_DATA13: GumstixInterface (U16.J4-52), GumstixEthernetInterface (U15.21)
X_DATA14: GumstixInterface (U16.J4-50), GumstixEthernetInterface (U15.20)
X_DATA15: GumstixInterface (U16.J4-22), GumstixEthernetInterface (U15.19)
X_GPIO64_ETH0_NRESET: GumstixInterface (U16.J4-10), GumstixEthernetInterface (R37.2 U15.42)
X_GPIO176_ETH0_IRQ: GumstixInterface (U16.J4-9), GumstixEthernetInterface (R35.1 U15.43)
X_NCS5_ETHO: GumstixInterface (U16.J4-4), GumstixEthernetInterface (U15.17)
X_NOE: GumstixInterface (U16.J4-8), GumstixEthernetInterface (U15.15)
X_NPWE: GumstixInterface (U16.J4-6), GumstixEthernetInterface (U15.16)